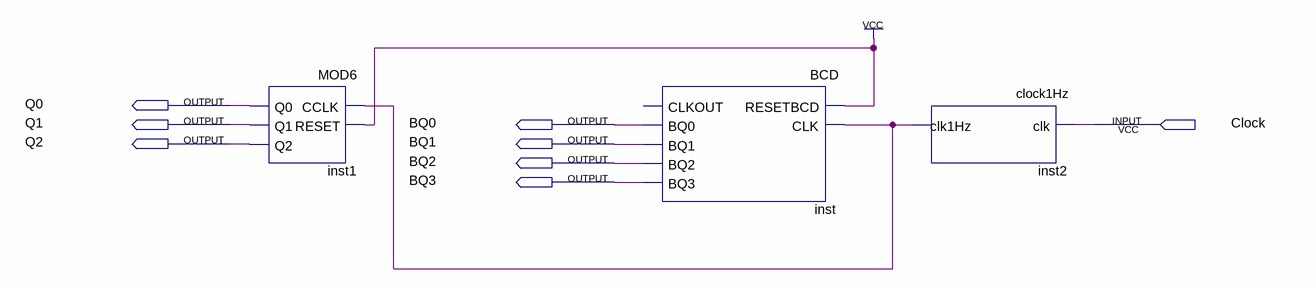
[diagram p0: schematic sheet]
// Quartus schematic MOD60.bdf as structural Verilog: 3 symbols, 8 pins
module MOD60 (
  input  Clock,
  output Q0,
  output Q1,
  output BQ0,
  output Q2,
  output BQ1,
  output BQ2,
  output BQ3
);

  wire inst2_clk1hz;

  MOD6 inst1 (.CCLK(inst2_clk1hz), .RESET(1'b1), .Q0(Q0), .Q1(Q1), .Q2(Q2));
  BCD inst (.RESETBCD(1'b1), .CLK(inst2_clk1hz), .BQ0(BQ0), .BQ1(BQ1), .BQ2(BQ2), .BQ3(BQ3));  // open: CLKOUT
  clock1Hz inst2 (.clk(Clock), .clk1Hz(inst2_clk1hz));
endmodule
